# Altium schematic sheet Power_In.SchDoc
size 431 x 279 mm; Organization: ORGANIZATION; Address1: ADDRESS 1; Address2: ADDRESS 2; Address3: ADDRESS 3; Address4: ADDRESS 4; Revision: -; SheetNumber: 8; SheetTotal: 8; ENG_APP_DATE: --/--/--; DSN_APP_DATE: --/--/--; CHK_APP_DATE: --/--/--
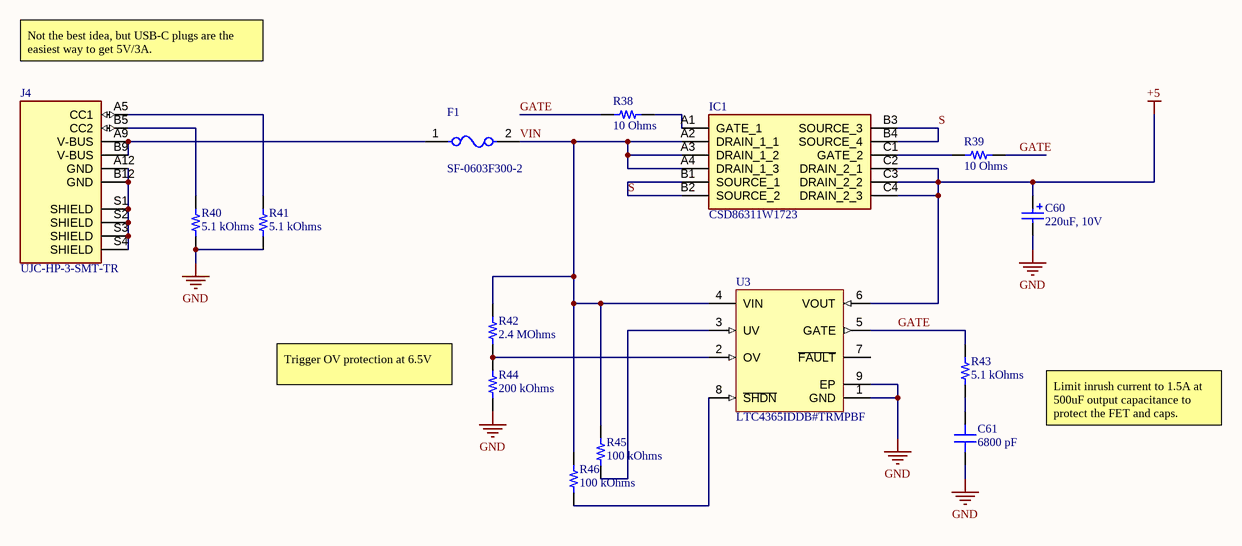
[diagram p0: Power_In.SchDoc]

## Parts
C60  220uF, 10V  [WCAP-PSLP_D6.3H5.8]
C61  6800 pF  [CAP 0402_1005]
F1  SF-0603F300-2  [FP-SF-0603S-MFG]
IC1  CSD86311W1723  [BGA12C50P4X3_228X170X62]
J4  UJC-HP-3-SMT-TR  [CUI_UJC-HP-3-SMT-TR]
R38  10 Ohms  [RES 0402_1005]
R39  10 Ohms  [RES 0402_1005]
R40  5.1 kOhms  [RES 0402_1005]
R41  5.1 kOhms  [RES 0402_1005]
R42  2.4 MOhms  [RES 0402_1005]
R43  5.1 kOhms  [RES 0402_1005]
R44  200 kOhms  [RES 0402_1005]
R45  100 kOhms  [RES 0402_1005]
R46  100 kOhms  [RES 0402_1005]
U3  LTC4365IDDB#TRMPBF  [LT-DDB-8_V]

## Nets
+5: C60.1(P) IC1.C2(DRAIN_2_1) IC1.C3(DRAIN_2_2) IC1.C4(DRAIN_2_3) U3.6(VOUT)
GND: C60.2(N) C61.1 R40.1 R41.1 R44.1 U3.1(GND) U3.9(EP)
GATE: R38.1 R39.2 R43.2 U3.5(GATE)
S: IC1.B1(SOURCE_1) IC1.B2(SOURCE_2) IC1.B3(SOURCE_3) IC1.B4(SOURCE_4)
VIN: F1.2 IC1.A2(DRAIN_1_1) IC1.A3(DRAIN_1_2) IC1.A4(DRAIN_1_3) R42.2 R45.2 R46.2 U3.4(VIN)
NetC61_2: C61.2 R43.1
NetF1_1: F1.1 J4.A9(V-BUS) J4.B9(V-BUS)
NetIC1_A1: IC1.A1(GATE_1) R38.2
NetIC1_C1: IC1.C1(GATE_2) R39.1
NetJ4_A5: J4.A5(CC1) R41.2
NetJ4_A12: J4.A12(GND) J4.B12(GND) J4.S1(SHIELD) J4.S2(SHIELD) J4.S3(SHIELD) J4.S4(SHIELD)
NetJ4_B5: J4.B5(CC2) R40.2
NetR42_1: R42.1 R44.2 U3.2(OV)
NetR45_1: R45.1 U3.3(UV)
NetR46_1: R46.1 U3.8(~{SHDN})

Not connected (* = marked no-connect by the designer): U3 7(~{FAULT})

## Notes on the sheet
- Not the best idea, but USB-C plugs are the easiest way to get 5V/3A.
- Trigger OV protection at 6.5V
- Limit inrush current to 1.5A at 500uF output capacitance to protect the FET and caps.
- DWG. NO.
- REV.
- SHT.
- REVISION
- DESCRIPTION
- DATE
- APPROVED
- ENG:
- APPROVALS
- PROJECT
- DSN:
- CHK:
- REFERENCE DOCUMENTS
- PROJECT REVISION:
- TITLE
- SimulaVR
- DOCUMENT REVISION:
- DESIGN ITEM:
- BOM:
- FAB DWG:
- PCB DWG:
- ASSY DWG:
- SCALE:
- SIZE
- B
- CAGE CODE
- FILE NAME
- DWG NO.
- SHEET
- OF
- REV

## Library data of the parts
C60 = 875105244013: WCAP-PSLP Aluminum Polymer Capacitor, V-Chip, SMT, D6.3xH5.8mm, 220uF, 10V; Manufacturer: Wurth Elektronik; Ripple Current: 1970mA; Technical Reference: PSED058221M010DVCTBB000; Capacitance Tolerance: +/-20%; Dissipation Factor: 8%; Rated Voltage: 10VDC; Leakage Current: 300uA; ESR: 30mOhm; Endurance: 2000h; ComponentLink1URL: http://www.we-online.de; ComponentLink1Description: Manufacturer; Capacitance: 220uF; Diameter: 6.3mm; Published Date: October 2020; Packaging: Tape and Reel; Operating Temperature: -55 to +105degC; Mounting Technology: SMT; Manufacturer Part Number: 875105244013; Height: 5.8mm; ComponentLink2URL: https://www.we-online.com/catalog/datasheet/875105244013.pdf; ComponentLink2Description: Datasheet
C61 = GCM155R71H682KA55D: CAP CER 6800PF 50V X7R 0402; manufacturer: Murata Electronics; Tolerance: ±10%; Part Number: GCM155R71H682KA55D; Value: 6800 pF; Applications: Automotive; Capacitance: 6800 pF; componentlink1description: Datasheet; componentlink1url: https://psearch.en.murata.com/capacitor/product/GCM155R71H682KA55%23.pdf; componentlink2description: DigiKey Link; componentlink2url: https://www.digikey.com/en/products/detail/murata-electronics/GCM155R71H682KA55D/2591333; Device Package: 0402 (1005 Metric); lastupdated: 2022-04-12 22:04:40; Lifecycle Status: Active; Minimum Order: 1; Mounting Type: Surface Mount, MLCC; Operating Temperature: -55°C ~ 125°C; Package / Case: 0402 (1005 Metric); packaging: TapeAndReel; partid: 10301; Part Status: Active; price: 0.01; Ratings: AEC-Q200; series: GCM; Size / Dimension: 0.039" L x 0.020" W (1.00mm x 0.50mm); Supplier 1: DigiKey; Supplier Part Number 1: 490-11152-1-ND; Temperature Coefficient: X7R; Thickness (Max): 0.022" (0.55mm); Voltage - Rated: 50V
F1 = CMP-07399-000004-1: FUSE BOARD MNT 3A 32VDC 0603 FAST BLOW; Manufacturer: Bourns Inc.; Fuse I2T: 0.009A2Sec; Description: 3A AC 32V DC Fuse Board Mount (Cartridge Style Excluded) Surface Mount 0603 (1608 Metric); Fuse Current: 0.5A; Fuse Interrupt Ac Current: 50A; Max Fuse Ac Voltage: 35V; Resistance: 20mΩ; Value: 20mΩ; Max Fuse Dc Voltage: 50V; Automotive: No; Category: Fuse; Temperature Range High: +105°C; Device Class L1: Circuit Protection; Height: 0.55mm; RoHS: TRUE; ComponentLink2URL: https://www.bourns.com/docs/product-datasheets/sf0603f.pdf; Ipc Land Pattern Name: CAPC16080X45; Temperature Range Low: -20°C; Manufacturer Part Number: SF-0603F300-2; Package: SF-0603F; Device Class L3: unset; Device Class L2: Fuses; Fuse Blow Speed: Fast; Lead Free: Yes; Temperature: -20°C to +105°C; ComponentLink2Description: Datasheet; Fuse Interrupt Dc Current: 50A
IC1 = CSD86311W1723: Integrated Circuit; Manufacturer_Name: Texas Instruments; Datasheet Link: http://www.ti.com/lit/ds/symlink/csd86311w1723.pdf; Height: 0.62mm; Manufacturer_Part_Number: CSD86311W1723; Mouser Part Number: 595-CSD86311W1723; Mouser Price/Stock: https://www.mouser.com/Search/Refine.aspx?Keyword=595-CSD86311W1723; Arrow Part Number: CSD86311W1723; Arrow Price/Stock: https://www.arrow.com/en/products/csd86311w1723/texas-instruments
J4 = UJC-HP-3-SMT-TR: Type C, 3 A, Right Angle, Surface Mount (SMT), Power-Only USB Receptacle; MF: {'manufacturer': u'CUI Devices'}; MP: UJC-HP-3-SMT-TR; Availability: Unavailable; Package: None; Price: None; Value: *
R38 R39 = CRGP0402F10R: RES 10 OHM 1% 1/8W 0402; Manufacturer: TE Connectivity Passive Product; Power (Watts): 0.125W, 1/8W; Temperature Coefficient: ±100ppm/°C; Part Number: CRGP0402F10R; Value: 10 Ohms; ComponentLink1Description: Datasheet; ComponentLink1URL: https://www.te.com/commerce/DocumentDelivery/DDEController?Action=srchrtrv&DocNm=9-1773463-9&DocType=DS&DocLang=English; ComponentLink2Description: DigiKey Link; ComponentLink2URL: https://www.digikey.com/en/products/detail/te-connectivity-passive-product/CRGP0402F10R/8576933; Composition: Thick Film; Device Package: 0402 (1005 Metric); Features: Pulse Withstanding; Height - Seated (Max): 0.016" (0.40mm); LastUpdated: 2022-04-12 22:21:07; Lifecycle Status: Active; Minimum Order: 1; Number of Terminations: 2; Operating Temperature: -55°C ~ 155°C; Package / Case: 0402 (1005 Metric); Packaging: TapeAndReel; PartId: 6240; Part Status: Active; Price: 0.01; Resistance: 10 Ohms; Series: CRGP; Size / Dimension: 0.043" L x 0.020" W (1.10mm x 0.50mm); Supplier 1: DigiKey; Supplier Part Number 1: A130331CT-ND; Supplier Device Package: 0402; Tolerance: ±1%
R40 R41 = RK73H1ETTP5101F: RES 5.1K OHM 1% 1/10W 0402; Manufacturer: KOA Speer Electronics, Inc.; Power (Watts): 0.1W, 1/10W; Temperature Coefficient: ±100ppm/°C; Part Number: RK73H1ETTP5101F; Value: 5.1 kOhms; ComponentLink1Description: Datasheet; ComponentLink1URL: http://www.koaspeer.com/catimages/Products/RK73H/RK73H.pdf; ComponentLink2Description: DigiKey Link; ComponentLink2URL: http://digikey.com/product-detail/en/koa-speer-electronics-inc/RK73H1ETTP5101F/2019-RK73H1ETTP5101FCT-ND/9846162; Composition: Thick Film; Device Package: 0402 (1005 Metric); Features: Automotive AEC-Q200, Moisture Resistant; Height - Seated (Max): 0.016" (0.40mm); LastUpdated: 2022-04-12 22:20:52; Lifecycle Status: Active; Minimum Order: 1; Number of Terminations: 2; Operating Temperature: -55°C ~ 155°C; Package / Case: 0402 (1005 Metric); Packaging: CutTape; PartId: 10155; Part Status: Active; Price: 0.10; Ratings: AEC-Q200; Resistance: 5.1 kOhms; Series: RK73H; Size / Dimension: 0.039" L x 0.020" W (1.00mm x 0.50mm); Supplier 1: DigiKey; Supplier Part Number 1: 2019-RK73H1ETTP5101FCT-ND; Supplier Device Package: 0402; Tolerance: ±1%
R42 = CRCW04022M40FKED: RES SMD 2.4M OHM 1% 1/16W 0402; Manufacturer: Vishay Dale; Power (Watts): 0.063W, 1/16W; Temperature Coefficient: ±100ppm/°C; Part Number: CRCW04022M40FKED; Value: 2.4 MOhms; ComponentLink1Description: Datasheet; ComponentLink1URL: http://www.vishay.com/docs/20035/dcrcwe3.pdf; ComponentLink2Description: DigiKey Link; ComponentLink2URL: https://www.digikey.com/en/products/detail/vishay-dale/CRCW04022M40FKED/1178390; Composition: Thick Film; Device Package: 0402 (1005 Metric); Features: Automotive AEC-Q200; Height - Seated (Max): 0.016" (0.40mm); LastUpdated: 2022-04-12 22:20:22; Lifecycle Status: Active; Minimum Order: 1; Number of Terminations: 2; Operating Temperature: -55°C ~ 155°C; Package / Case: 0402 (1005 Metric); Packaging: CutTape; PartId: 17261; Part Status: Active; Price: 0.01; Ratings: AEC-Q200; Resistance: 2.4 MOhms; Series: CRCW; Size / Dimension: 0.039" L x 0.020" W (1.00mm x 0.50mm); Supplier 1: DigiKey; Supplier Part Number 1: 541-2.40MLCT-ND; Supplier Device Package: 0402; Tolerance: ±1%
R43 = ERJ-2GEJ512X: RES SMD 5.1K OHM 5% 1/10W 0402; Manufacturer: Panasonic Electronic Components; Power (Watts): 0.1W, 1/10W; Temperature Coefficient: ±200ppm/°C; Part Number: ERJ-2GEJ512X; Value: 5.1 kOhms; ComponentLink1Description: Datasheet; ComponentLink1URL: https://b2b-api.panasonic.eu/file_stream/pids/fileversion/1242; ComponentLink2Description: DigiKey Link; ComponentLink2URL: https://www.digikey.com/en/products/detail/panasonic-electronic-components/ERJ-2GEJ512X/147044; Composition: Thick Film; Device Package: 0402 (1005 Metric); Features: Automotive AEC-Q200; Height - Seated (Max): 0.016" (0.40mm); LastUpdated: 2022-04-12 22:20:27; Lifecycle Status: Active; Minimum Order: 1; Number of Terminations: 2; Operating Temperature: -55°C ~ 155°C; Package / Case: 0402 (1005 Metric); Packaging: CutTape; PartId: 16183; Part Status: Active; Price: 0.01; Ratings: AEC-Q200; Resistance: 5.1 kOhms; Series: ERJ-2G; Size / Dimension: 0.039" L x 0.020" W (1.00mm x 0.50mm); Supplier 1: DigiKey; Supplier Part Number 1: P5.1KJCT-ND; Supplier Device Package: 0402; Tolerance: ±5%
R44 = RMCF0402FT200K: RES 200K OHM 1% 1/16W 0402; Manufacturer: Stackpole Electronics Inc; Power (Watts): 0.063W, 1/16W; Temperature Coefficient: ±100ppm/°C; Part Number: RMCF0402FT200K; Value: 200 kOhms; ComponentLink1Description: Datasheet; ComponentLink1URL: https://www.seielect.com/catalog/sei-rmcf_rmcp.pdf; ComponentLink2Description: DigiKey Link; ComponentLink2URL: https://www.digikey.com/en/products/detail/stackpole-electronics-inc/RMCF0402FT200K/1714538; Composition: Thick Film; Device Package: 0402 (1005 Metric); Features: Automotive AEC-Q200; Height - Seated (Max): 0.016" (0.40mm); LastUpdated: 2022-04-12 22:21:12; Lifecycle Status: Active; Minimum Order: 1; Number of Terminations: 2; Operating Temperature: -55°C ~ 155°C; Package / Case: 0402 (1005 Metric); Packaging: CutTape; PartId: 5001; Part Status: Active; Price: 0.01; Ratings: AEC-Q200; Resistance: 200 kOhms; Series: RMCF; Size / Dimension: 0.039" L x 0.020" W (1.00mm x 0.50mm); Supplier 1: DigiKey; Supplier Part Number 1: RMCF0402FT200KCT-ND; Supplier Device Package: 0402; Tolerance: ±1%
R45 R46 = RCS0402100KJNED: RES SMD 100K OHM 5% 1/5W 0402; Manufacturer: Vishay Dale; Power (Watts): 0.2W, 1/5W; Temperature Coefficient: ±200ppm/°C; Part Number: RCS0402100KJNED; Value: 100 kOhms; ComponentLink1Description: Datasheet; ComponentLink1URL: http://www.vishay.com/docs/20065/rcse3.pdf; ComponentLink2Description: DigiKey Link; ComponentLink2URL: http://digikey.com/product-detail/en/vishay-dale/RCS0402100KJNED/541-2919-1-ND/5867212; Composition: Thick Film; Device Package: 0402 (1005 Metric); Features: Automotive AEC-Q200, Pulse Withstanding; Height - Seated (Max): 0.016" (0.40mm); LastUpdated: 2022-04-12 22:21:10; Lifecycle Status: Active; Minimum Order: 1; Number of Terminations: 2; Operating Temperature: -55°C ~ 155°C; Package / Case: 0402 (1005 Metric); Packaging: TapeAndReel; PartId: 5535; Part Status: Active; Price: 0.01; Ratings: AEC-Q200; Resistance: 100 kOhms; Series: RCS e3; Size / Dimension: 0.039" L x 0.020" W (1.00mm x 0.50mm); Supplier 1: DigiKey; Supplier Part Number 1: 541-2919-1-ND; Supplier Device Package: 0402; Tolerance: ±5%
U3 = CMP-0474-00046-1: UV, OV and Reverse Supply Protection Controller, 2.5 to 34 V Vin, 8-pin SON (DDB-8), -40 to 85 degC, Pb-Free, Mini Tape and Reel; Manufacturer: Linear Technology; Extended Temp: C, I, H; Circuit Breakers(#): 1; Fast Comparator: no; Fault: yes; PackageDescription: 8-Pin Plastic DFN, Body 3 x 2 mm, Pitch 0.5 mm; RoHS: TRUE; PackageVersion: Rev. B, 06/2010; ComponentLink2URL: http://cds.linear.com/docs/en/datasheet/4365f.pdf; PackageReference: DDB-8; ComponentLink1URL: http://www.linear.com/; ComponentLink3Description: Package Specification; Code_JEDEC: MO-229; Mounting Technology: Surface Mount; ComponentLink3URL: http://cds.linear.com/docs/en/packaging/DFN_8_05-08-1702.pdf; Active Limiting: no; Reset: no; Foldback: no; ComponentLink2Description: Datasheet; ComponentLink1Description: Manufacturer URL; Packing: Mini Tape and Reel; Power Good: no; PartNumber: LTC4365IDDB#TRMPBF; Vin Range: 2.5 to 34 V